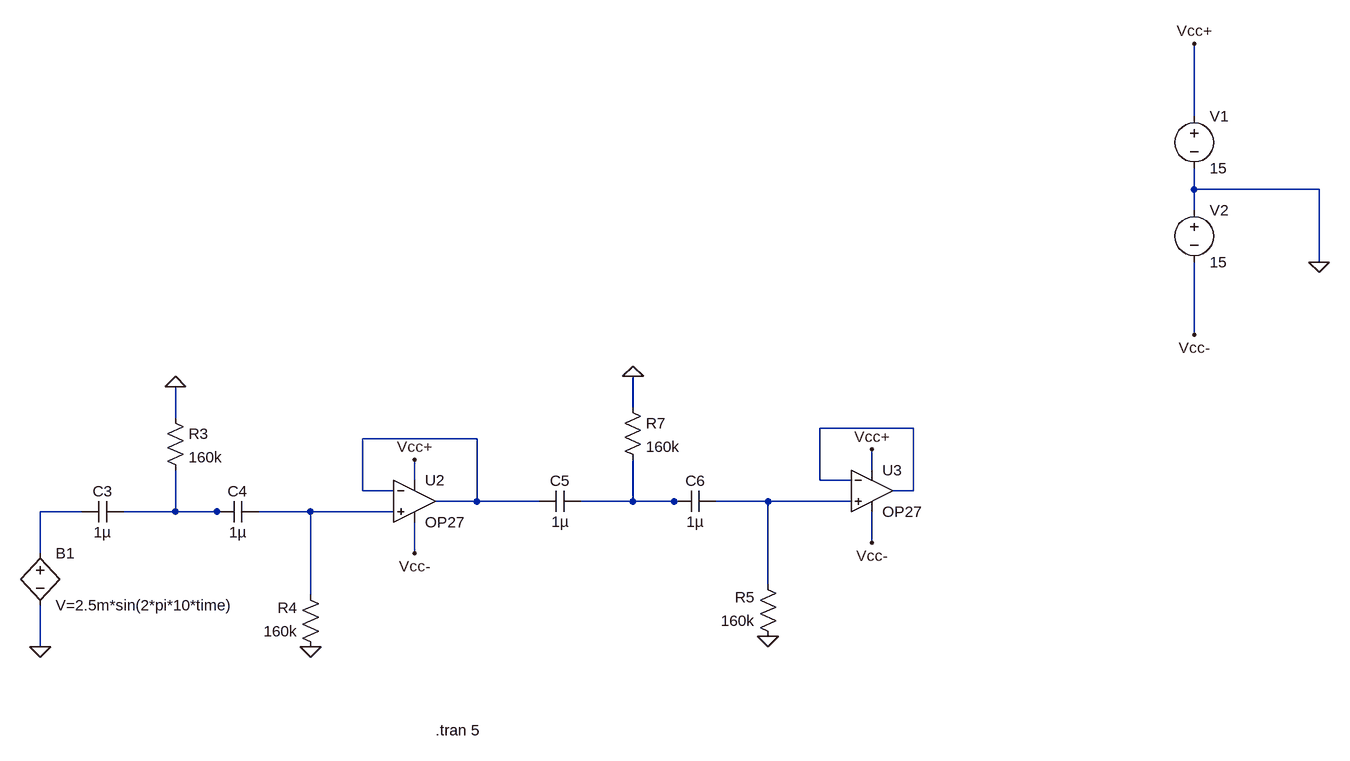
[diagram p0: schematic HighPassFilter_ver2.asc]
HighPassFilter_ver2.asc, the LTspice schematic file:
Version 4.1
SHEET 1 1844 1460
WIRE 1632 -64 1632 -176
WIRE 1632 48 1632 16
WIRE 1824 48 1632 48
WIRE 1632 80 1632 48
WIRE 1824 160 1824 48
WIRE 1632 272 1632 160
WIRE 768 384 768 336
WIRE 64 400 64 352
WIRE 1200 416 1056 416
WIRE 528 432 352 432
WIRE 1136 480 1136 448
WIRE 432 496 432 464
WIRE 1056 496 1056 416
WIRE 1104 496 1056 496
WIRE 352 512 352 432
WIRE 400 512 352 512
WIRE 1200 512 1200 416
WIRE 1200 512 1168 512
WIRE 528 528 528 432
WIRE 528 528 464 528
WIRE 624 528 528 528
WIRE 768 528 768 464
WIRE 768 528 688 528
WIRE 832 528 768 528
WIRE 848 528 832 528
WIRE 976 528 896 528
WIRE 1104 528 976 528
WIRE -80 544 -144 544
WIRE 64 544 64 480
WIRE 64 544 -16 544
WIRE 128 544 64 544
WIRE 144 544 128 544
WIRE 272 544 192 544
WIRE 400 544 272 544
WIRE 1136 592 1136 544
WIRE -144 608 -144 544
WIRE 432 608 432 560
WIRE 976 656 976 528
WIRE 272 672 272 544
WIRE -144 752 -144 688
FLAG 1824 160 0
FLAG 1632 -176 Vcc+
FLAG 1632 272 Vcc-
FLAG -144 752 0
FLAG 272 752 0
FLAG 432 464 Vcc+
FLAG 432 608 Vcc-
FLAG 64 352 0
FLAG 976 736 0
FLAG 1136 448 Vcc+
FLAG 1136 592 Vcc-
FLAG 768 336 0
SYMBOL voltage 1632 -80 R0
SYMATTR InstName V1
SYMATTR Value 15
SYMBOL voltage 1632 64 R0
SYMATTR InstName V2
SYMATTR Value 15
SYMBOL cap -16 528 R90
WINDOW 0 0 32 VBottom 2
WINDOW 3 32 32 VTop 2
SYMATTR InstName C3
SYMATTR Value 1µ
SYMBOL cap 192 528 R90
WINDOW 0 0 32 VBottom 2
WINDOW 3 32 32 VTop 2
SYMATTR InstName C4
SYMATTR Value 1µ
SYMBOL res 288 768 R180
WINDOW 0 36 76 Left 2
WINDOW 3 36 40 Left 2
SYMATTR InstName R4
SYMATTR Value 160k
SYMBOL OpAmps\\OP27 432 464 R0
SYMATTR InstName U2
SYMBOL res 48 384 R0
SYMATTR InstName R3
SYMATTR Value 160k
SYMBOL cap 688 512 R90
WINDOW 0 0 32 VBottom 2
WINDOW 3 32 32 VTop 2
SYMATTR InstName C5
SYMATTR Value 1µ
SYMBOL cap 896 512 R90
WINDOW 0 0 32 VBottom 2
WINDOW 3 32 32 VTop 2
SYMATTR InstName C6
SYMATTR Value 1µ
SYMBOL res 992 752 R180
WINDOW 0 36 76 Left 2
WINDOW 3 36 40 Left 2
SYMATTR InstName R5
SYMATTR Value 160k
SYMBOL OpAmps\\OP27 1136 448 R0
SYMATTR InstName U3
SYMBOL res 752 368 R0
SYMATTR InstName R7
SYMATTR Value 160k
SYMBOL bv -144 592 R0
SYMATTR InstName B1
SYMATTR Value V=2.5m*sin(2*pi*10*time)
TEXT 464 880 Left 2 !.tran 5

The netlist it stands for:
* HighPassFilter_ver2.asc
V1 Vcc+ 0 15
V2 0 Vcc- 15
C3 N006 N005 1µ
C4 N007 N006 1µ
R4 0 N007 160k
X§U2 N007 N002 Vcc+ Vcc- N002 OP27  ; pins In+ In- V+ V- OUT
R3 0 N006 160k
C5 N003 N002 1µ
C6 N004 N003 1µ
R5 0 N004 160k
X§U3 N004 N001 Vcc+ Vcc- N001 OP27  ; pins In+ In- V+ V- OUT
R7 0 N003 160k
B1 N005 0 V=2.5m*sin(2*pi*10*time)
.tran 5
.lib ADI.lib
.backanno
.end